# Altium project Analog RPM Sensor.PrjPcb
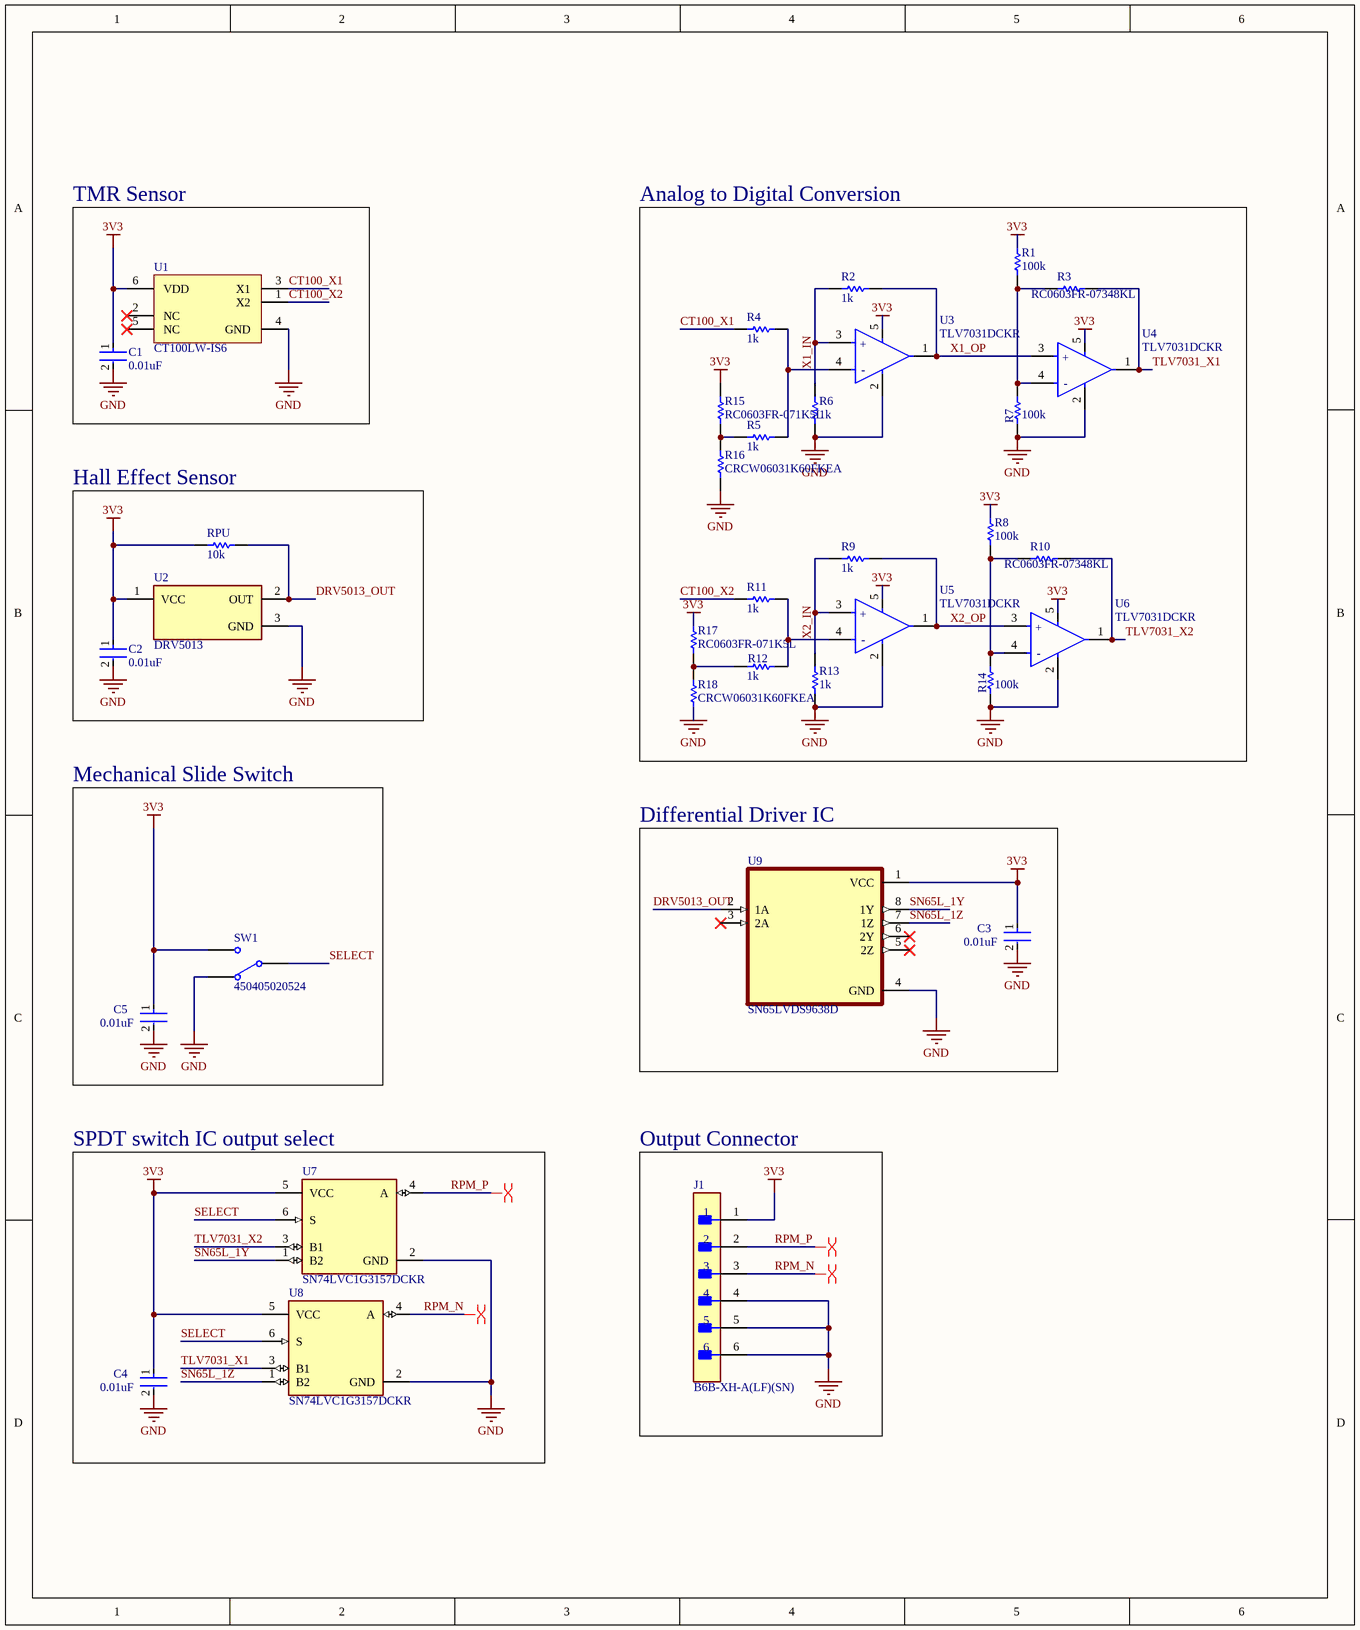
[diagram p0: Analog RPM Schematic.SchDoc]
1 sheet, 35 parts. Net scope: global (net labels, ports and power ports of the same name join across sheets).
Board file: Analog RPM PCB.PcbDoc

## Sheet Analog RPM Schematic.SchDoc
size 254 x 304 mm

### Parts
C1  0.01uF  [FP-GRM188-0_1-e0_2_0_55-IPC_A]
C2  0.01uF  [FP-GRM188-0_1-e0_2_0_55-IPC_A]
C3  0.01uF  [FP-GRM188-0_1-e0_2_0_55-IPC_A]
C4  0.01uF  [FP-GRM188-0_1-e0_2_0_55-IPC_A]
C5  0.01uF  [FP-GRM188-0_1-e0_2_0_55-IPC_A]
J1  B6B-XH-A(LF)(SN)  [FP-B6B-XH-A_LF_SN-MFG]
R1  value 100k  [RESC2013X70X40NL20T20]  (hidden comment: Resistor 100K +/-5% 0805 125 mW)
R2  value 1k  [RESC2013X70X40NL20T20]  (hidden comment: Resistor 1K +/-5% 0805 500 mW)
R3  RC0603FR-07348KL  [RESC1608X55X25LL10T15]
R4  value 1k  [RESC2013X70X40NL20T20]  (hidden comment: Resistor 1K +/-5% 0805 500 mW)
R5  value 1k  [RESC2013X70X40NL20T20]  (hidden comment: Resistor 1K +/-5% 0805 500 mW)
R6  value 1k  [RESC2013X70X40NL20T20]  (hidden comment: Resistor 1K +/-5% 0805 500 mW)
R7  value 100k  [RESC2013X70X40NL20T20]  (hidden comment: Resistor 100K +/-5% 0805 125 mW)
R8  value 100k  [RESC2013X70X40NL20T20]  (hidden comment: Resistor 100K +/-5% 0805 125 mW)
R9  value 1k  [RESC2013X70X40NL20T20]  (hidden comment: Resistor 1K +/-5% 0805 500 mW)
R10  RC0603FR-07348KL  [RESC1608X55X25LL10T15]
R11  value 1k  [RESC2013X70X40NL20T20]  (hidden comment: Resistor 1K +/-5% 0805 500 mW)
R12  value 1k  [RESC2013X70X40NL20T20]  (hidden comment: Resistor 1K +/-5% 0805 500 mW)
R13  value 1k  [RESC2013X70X40NL20T20]  (hidden comment: Resistor 1K +/-5% 0805 500 mW)
R14  value 100k  [RESC2013X70X40NL20T20]  (hidden comment: Resistor 100K +/-5% 0805 125 mW)
R15  RC0603FR-071K5L  [RESC1608X55X25ML10T15]
R16  CRCW06031K60FKEA  [RESC1609X50X30LL10T20]
R17  RC0603FR-071K5L  [RESC1608X55X25ML10T15]
R18  CRCW06031K60FKEA  [RESC1609X50X30LL10T20]
RPU  10k  [RESC1609X50X30NL8T20]
SW1  450405020524  [450405020524]
U1  CT100LW-IS6  [SOT95P280X120-6_CT100LW-IS6_N]
U2  DRV5013  [FP-DBZ0003A-MFG]
U3  TLV7031DCKR  [FP-DCK0005A-IPC_A]
U4  TLV7031DCKR  [FP-DCK0005A-IPC_A]
U5  TLV7031DCKR  [FP-DCK0005A-IPC_A]
U6  TLV7031DCKR  [FP-DCK0005A-IPC_A]
U7  SN74LVC1G3157DCKR  [FP-DCK0006A-MFG]
U8  SN74LVC1G3157DCKR  [FP-DCK0006A-MFG]
U9  SN65LVDS9638D  [SOIC127P599X175-8N]

### Blocks framed on the sheet
TMR Sensor: C1 U1
Analog to Digital Conversion: R1-R18 U3-U6
Hall Effect Sensor: C2 RPU U2
Mechanical Slide Switch: C5 SW1
Differential Driver IC: C3 U9
SPDT switch IC output select: C4 U7 U8
Output Connector: J1

### Nets
3V3: C1.1 C2.1 C3.1 C4.1 C5.1 J1.1 R1.1 R8.1 R15.2 R17.2 RPU.1 SW1.L2 U1.6(VDD) U2.1(VCC) U3.5(VCC) U4.5(VCC) U5.5(VCC) U6.5(VCC) U7.5(VCC) U8.5(VCC) U9.1(VCC)
GND: C1.2 C2.2 C3.2 C4.2 C5.2 J1.4 J1.5 J1.6 R6.2 R7.2 R13.2 R14.2 R16.1 R18.1 SW1.L1 U1.4(GND) U2.3(GND) U3.2(VEE) U4.2(VEE) U5.2(VEE) U6.2(VEE) U7.2(GND) U8.2(GND) U9.4(GND)
CT100_X1: R4.1 U1.3(X1)
CT100_X2: R11.1 U1.1(X2)
DRV5013_OUT: RPU.2 U2.2(OUT) U9.2(1A)
RPM_N: J1.3 U8.4(A)
RPM_P: J1.2 U7.4(A)
SELECT: SW1.COM U7.6(S) U8.6(S)
SN65L_1Y: U7.1(B2) U9.8(1Y)
SN65L_1Z: U8.1(B2) U9.7(1Z)
TLV7031_X1: R3.2 U4.1(OUT) U8.3(B1)
TLV7031_X2: R10.2 U6.1(OUT) U7.3(B1)
X1_IN: R2.1 R4.2 R5.2 R6.1 U3.3(IN+) U3.4(IN-)
X1_OP: R2.2 U3.1(OUT) U4.3(IN+)
X2_IN: R9.1 R11.2 R12.2 R13.1 U5.3(IN+) U5.4(IN-)
X2_OP: R9.2 U5.1(OUT) U6.3(IN+)
NetR1_2: R1.2 R3.1 R7.1 U4.4(IN-)
NetR5_1: R5.1 R15.1 R16.2
NetR8_2: R8.2 R10.1 R14.1 U6.4(IN-)
NetR12_1: R12.1 R17.1 R18.2

Not connected (* = marked no-connect by the designer): U1 2(NC)* 5(NC)*; U9 3(2A)* 5(2Z)* 6(2Y)*

### Layout directives
differential pair: RPM_N, RPM_P

### Notes on the sheet
- (in symbol CMP-04896-000085-1) +; -

### Library data of the parts
C1-C5 = CMP-2006-02792-2: Chip Multilayer Ceramic Capacitors for General Purpose, 0603, 10uF, X5R, 15%, 20%, 6.3V; Packaging: Tape and Reel; Voltage Rating (DC): 6.3V; Width: 0.031inch; Termination: SMD/SMT; Dielectric: X5R; Package Quantity: 4000; Voltage Rating: 6.3V; Capacitance: 10uF; Case/Package: 0603; Min Operating Temperature: -55°C; Voltage: 6.3V; Length: 1.6mm; Thickness: 0.035inch; Lead Free: Lead Free; Depth: 0.8mm; Case Code (Imperial): 0603; Max Operating Temperature: 85°C; Material: Ceramic; Height: 0.8mm; Tolerance: 20%; Mount: Surface Mount; REACH SVHC: No SVHC; Radiation Hardening: No; Case Code (Metric): 1608
J1 = CMP-17439-000076-1: CONN HEADER VERT 6POS 2.5MM
R1 R7 R8 R14 = CMP-009-00217-1: Fixed Resistor, Metal Glaze/thick Film, 0.125W, 100000ohm, 150V, 5% +/-Tol, 200ppm/Cel, Surface Mount, 0805; Rated Temperature: 70°C; Package Height: 0.6mm; Package Width: 1.25mm; Package Length: 2mm; Temperature Coefficient: 200ppm/°C; Power: 125mW; Reference Standard: AEC-Q200; Construction: Rectangular; Tolerance: 5%; Case/Package: 0805; Working Voltage: 150V; Reach SVHC Compliant: Yes; Terminal Finish: Nickel; Technology: METAL GLAZE/THICK FILM; Min Operating Temperature: -55°C; JESD-609 Code: e3; Mounting Technology: Surface Mount; Max Operating Temperature: 155°C; Resistor Type: FIXED RESISTOR; Packaging: Tape and Reel; Pins: 2; RoHS Compliant: Yes; Package Shape: Rectangular; Termination: Wraparound
R2 R4-R6 R9 R11-R13 = CMP-009-00218-1: Fixed Resistor, Metal Glaze/thick Film, 0.5W, 1000ohm, 400V, 5% +/-Tol, 200ppm/Cel, Surface Mount, 0805; Package Width: 1.25mm; Rated Temperature: 70°C; Temperature Coefficient: 200ppm/°C; Package Height: 0.6mm; Power: 500mW; Package Length: 2mm; Reference Standard: AEC-Q200; Working Voltage: 400V; JESD-609 Code: e3; Packaging: Tape and Reel; Reach SVHC Compliant: Yes; Technology: METAL GLAZE/THICK FILM; RoHS Compliant: Yes; Max Operating Temperature: 155°C; Case/Package: 0805; Tolerance: 5%; Mounting Technology: Surface Mount; Package Shape: Rectangular; Construction: Rectangular; Resistor Type: FIXED RESISTOR; Pins: 2; Terminal Finish: Tin; Min Operating Temperature: -55°C; Termination: Wraparound
R3 R10 = CMP-2000-04017-1: Manufacturer: Yageo; Part Number: RC0603FR-07348KL
R15 R17 = CMP-2100-03665-1: Chip Resistor, 1.5 KOhm, +/- 1%, 0.1 W, -55 to 155 degC, 0603 (1608 Metric), RoHS, Tape and Reel; Manufacturer: Yageo; Power Rating: 100mW; Voltage Rating: 50V; Temperature Coefficient: 100ppm/degreesC; Military Standard: Not; Datasheet URL: http://www.yageo.com/NewPortal/yageodocoutput?fileName=/pdf/R-Chip/PYu-RC_Group_51_RoHS_L_5.pdf; Package Description: 2-Pin Surface Mount Device, Body 1.6 x 0.8 mm; Composition: ThickFilm; Case Code (Metric): 1608; Case/Package: 0603; Number of Terminations: 2; Depth: 0.8mm; Height: 0.022inch; Manufacturer URL: http://www.yageo.com/; Lead Free: LeadFree; Min Operating Temperature: -55degC; Max Operating Temperature: 155degC; Datasheet Version: Rev. 5, 10/2016; RoHSCompliant: true; Max Power Dissipation: 100mW; Packaging: TapeandReel; Voltage Rating (DC): 50V; Length: 0.063inch; Tolerance: 1%; Width: 0.031inch; Number of Pins: 2; Termination: SMD/SMT; Package Reference: 0603; Package Quantity: 1; Case Code (Imperial): 0603; Resistance: 1.5KOhm; REACH SVHC: NoSVHC
R16 R18 = CMP-2000-03000-1: Manufacturer: Vishay Dale; Part Number: CRCW06031K60FKEA
RPU = CMP-1666-00005-4: Chip Resistor, 10 KOhm, +/- 1%, 100 mW, -55 to 155 degC, 0603 (1608 Metric), RoHS, Tape and Reel; Manufacturer: Vishay Semiconductor; Voltage Rating: 75 V; Max Operating Temperature: 155 degC; PackageDescription: 2-Pin Surface Mount Device, Body 1.575 x 0.85 mm; ComponentLink1Description: Manufacturer URL; RoHSCompliant: true; PackageReference: 0603; REACH SVHC: Unknown; Length: 1.55 mm; DatasheetVersion: 06/2012; Packaging: Tape and Reel; Min Operating Temperature: -55 degC; Mounting Technology: Surface Mount; ComponentLink2URL: https://datasheet.ciiva.com/11809/0900766b80d98afc-11809037.pdf; Height: 0.45 mm; ComponentLink2Description: Datasheet; Package Quantity: 5000; ComponentLink1URL: http://www.vishay.com/
SW1 = CMP-03913-107782335-1: 450405020524 WS-SLSU Mini Slide Switch; Insulation Resistance: 100MΩ; Min Operating Temperature: -40°C; RoHS: Compliant; Max Operating Temperature: 85°C; Packaging: Tape and Reel; NexarPartId: 107782335; Contact Plating: Silver
U1 = CMP-08330-103130247-1: Differential TMR high sensitivity Magnetic 1D Linear sensor; ComponentLink2Description: Datasheet URL; ComponentLink1URL: http://www.allegromicro.com/; HelpURL: https://www.allegromicro.com/-/media/files/datasheets/ct100-datasheet.pdf; ComponentLink2URL: https://www.allegromicro.com/-/media/files/datasheets/ct100-datasheet.pdf; ComponentLink1Description: Manufacturer's Website; RoHS: Compliant
U2 = CMP-04937-000026-1: SENSOR HALL ANALOG SOT23-3; Min Supply Voltage: 2.5V; Output Current: 2.3mA; Max Supply Voltage: 38V; Min Operating Temperature: -40°C; Number of Pins: 3; Contact Plating: Gold; Radiation Hardening: No; Packaging: Tape and Reel; Mount: Surface Mount; Case/Package: SOT-23; Lead Free: Lead Free; Max Operating Temperature: 125°C; RoHS Compliant: Yes
U3-U6 = CMP-04896-000085-1: VOLTAGE COMPARATOR; Number of Channels: 1; Hysteresis: 7mV; Max Input Current: 2pA; Power Supply Rejection Ratio (PSRR): 77dB; Propagation Delay: 3us; Input Offset Voltage (Vos): 8mV; Quiescent Current: 900nA; Packaging: Tape and Reel; Max Operating Temperature: 125°C; Type: General Purpose; Common Mode Rejection Ratio: 77dB; RoHS Compliant: Yes; Input Bias Current: 2pA; Min Operating Temperature: -40°C; Number of Elements: 1; Mount: Surface Mount
U7 U8 = CMP-011-00018-1: SPDT, 1 Func, 1 Channel, CMOS, PDSO6; Max Operating Temperature: 85°C; Min Operating Temperature: -40°C; RoHS Compliant: Yes
U9 = CMP-092-000000-1: 1500-Mbps LVDS dial high speed differential driver; MF: Texas Instruments; MP: SN65LVDS9638D; Source: SN65LVDS9638D.SchLib; Value: *; Pin Count: 8; Component Type: Standard; Design Item ID: SN65LVDS9638D; Check_prices: https://www.snapeda.com/parts/SN65LVDS9638D/Texas+Instruments/view-part/?ref=eda; SnapEDA_Link: https://www.snapeda.com/parts/SN65LVDS9638D/Texas+Instruments/view-part/?ref=snap; Package: SOIC-8 Texas Instruments